# Altium schematic sheet ADC_CURRENT_PUMP.SchDoc
size 393 x 281 mm; PageSetup: Record=PageOptions|CenterHorizontal=True|CenterVertical=True|PrintScale=0.94|XCorrection=0.00|YCorrection=0.00|PrintKind=0|BorderSize=5000000|LeftOffset=0|BottomOffset=0|Orientation=2|PaperLength=1000|PaperWidth=1000|Scale=100|PaperSource=15|PrintQuality=600|MediaType=1|DitherType=10|PrintScaleMode=1|PaperKind=A4; Adr1: August Barks gata 6B; Adr2: SE-421 32 Västra Frölunda; Adr3: Sweden; Webpage: www.omnisys.se
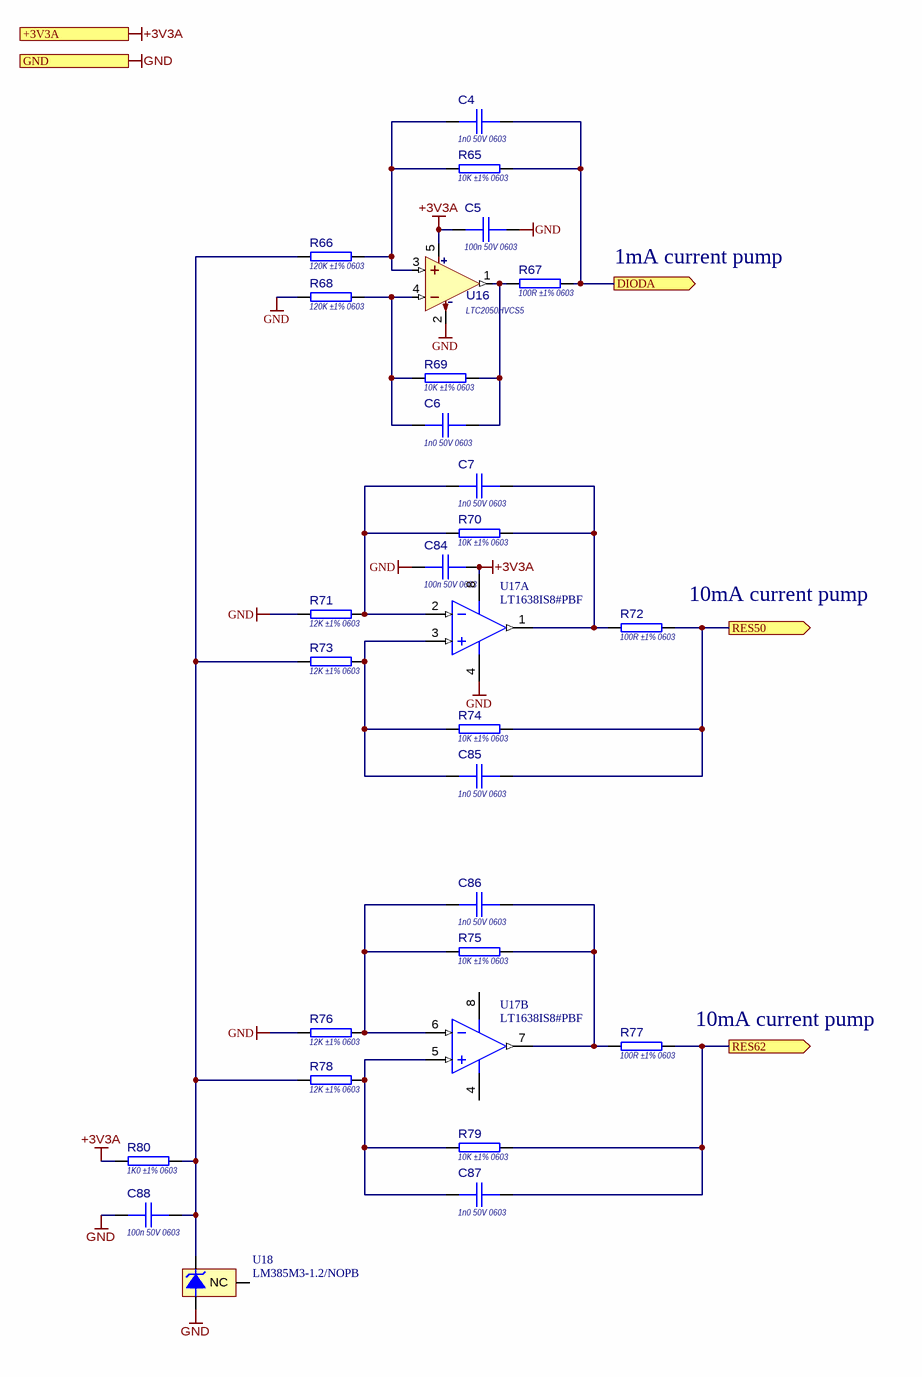
[diagram p0: ADC_CURRENT_PUMP.SchDoc]

## Parts
C4  1n0 50V 0603  [CAPC1608X90N]
C5  100n 50V 0603  [CAPC1608X90N]
C6  1n0 50V 0603  [CAPC1608X90N]
C7  1n0 50V 0603  [CAPC1608X90N]
C84  100n 50V 0603  [CAPC1608X90N]
C85  1n0 50V 0603  [CAPC1608X90N]
C86  1n0 50V 0603  [CAPC1608X90N]
C87  1n0 50V 0603  [CAPC1608X90N]
C88  100n 50V 0603  [CAPC1608X90N]
R65  10K ±1% 0603  [RESC1608N]
R66  120K ±1% 0603  [RESC1608N]
R67  100R ±1% 0603  [RESC1608N]
R68  120K ±1% 0603  [RESC1608N]
R69  10K ±1% 0603  [RESC1608N]
R70  10K ±1% 0603  [RESC1608N]
R71  12K ±1% 0603  [RESC1608N]
R72  100R ±1% 0603  [RESC1608N]
R73  12K ±1% 0603  [RESC1608N]
R74  10K ±1% 0603  [RESC1608N]
R75  10K ±1% 0603  [RESC1608N]
R76  12K ±1% 0603  [RESC1608N]
R77  100R ±1% 0603  [RESC1608N]
R78  12K ±1% 0603  [RESC1608N]
R79  10K ±1% 0603  [RESC1608N]
R80  1K0 ±1% 0603  [RESC1608N]
U16  LTC2050HVCS5  [SOT95P280X100-5N]
U17  LT1638IS8#PBF  [LT-S8-8_N]  (parts A,B of 2)
U18  LM385M3-1.2/NOPB  [DBZ0003A_L]

## Ports
+3V3A, DIODA (out), GND, RES50 (out), RES62 (out)

## Nets
+3V3A: C5.2 C84.2 R80.2 U16.5(+V) U17.8(V+) ; port +3V3A
GND: C5.1 C84.1 C88.1 R68.1 R71.1 R76.1 U16.2(-V) U17.4(V-) U18.2(-V) ; port GND
DIODA: C4.1 R65.2 R67.1 ; port DIODA
RES50: C85.1 R72.1 R74.2 ; port RES50
RES62: C87.1 R77.1 R79.1 ; port RES62
NetC4_2: C4.2 R65.1 R66.2 U16.3(+IN)
NetC6_1: C6.1 R67.2 R69.2 U16.1(OUT)
NetC6_2: C6.2 R68.2 R69.1 U16.4(-IN)
NetC7_1: C7.1 R70.1 R72.2 U17.1(OUT_A)
NetC7_2: C7.2 R70.2 R71.2 U17.2(-IN_A)
NetC85_2: C85.2 R73.2 R74.1 U17.3(+IN_A)
NetC86_1: C86.1 R75.1 R77.2 U17.7(OUT_B)
NetC86_2: C86.2 R75.2 R76.2 U17.6(-IN_B)
NetC87_2: C87.2 R78.2 R79.2 U17.5(+IN_B)
NetC88_2: C88.2 R66.1 R73.1 R78.1 R80.1 U18.1(+V)

Not connected (* = marked no-connect by the designer): U18 3(NC)

## Notes on the sheet
- 1mA current pump
- (near R72) 10mA current pump
- (near R77) 10mA current pump
- Title:
- SVN:
- August Barks gata 6B
- SE-421 32 Västra Frölunda
- Omnisys Instruments AB
- PCB ASY:
- PCB:
- SVN Folder:
- www.omnisys.se
- Page:
- of
- Print date:
- Page size:
- A3
- Information contained in this drawing is confidential. Copying, distributing or use in any matter, other than that specified by OMNISYS INSTRUMENTS AB, is strictly prohibited.

## Library data of the parts
C4 C6 C7 C85-C87 = CMP-0300-002637-1: 1n0 50V X7R ±10% 0603 (1608 metric); PartNumber: GRM188R71H102KA01; Rated voltage (V): 50; Capacitance (F): 1.0n; Package: 1608/0603; Temperature Charateristics: X7R; Thickness (mm): 0.90; Tolerance: ±10%
C5 C84 C88 = CMP-0300-002665-2: 100n 50V X7R ±10% 0603 (1608 metric); PartNumber: GRM188R71H104KA93; Rated voltage (V): 50; Capacitance (F): 100.0n; Package: 1608/0603; Temperature Charateristics: X7R; Thickness (mm): 0.90; Tolerance: ±10%
R65 R69 R70 R74 R75 R79 = CMP-1800-002045-3: 10K ±1% ±100 ppm/˚C 0.10W 75V 0603 (1608 metric); Power: 100mW; Case-EIA: 0603; Case-Metric: 1608; Temp. Coefficent: 0.01%; Value: 10k; Maximum working voltage: 75V; Tolerance: 1%; Technology: SMT
R66 R68 = CMP-1800-002071-3: 120K ±1% ±100 ppm/˚C 0.10W 75V 0603 (1608 metric); Power: 100mW; Case-EIA: 0603; Case-Metric: 1608; Temp. Coefficent: 0.01%; Value: 120k; Maximum working voltage: 75V; Tolerance: 1%; Technology: SMT
R67 R72 R77 = CMP-1800-001998-3: 100R ±1% ±100 ppm/˚C 0.10W 75V 0603 (1608 metric); Value: 100; Power: 100mW; Case-EIA: 0603; Case-Metric: 1608; Temp. Coefficent: 0.01%; Maximum working voltage: 75V; Tolerance: 1%; Technology: SMT
R71 R73 R76 R78 = CMP-1800-002047-3: 12K ±1% ±100 ppm/˚C 0.10W 75V 0603 (1608 metric); Power: 100mW; Case-EIA: 0603; Case-Metric: 1608; Temp. Coefficent: 0.01%; Value: 12k; Maximum working voltage: 75V; Tolerance: 1%; Technology: SMT
R80 = CMP-1800-002021-3: 1K0 ±1% ±100 ppm/˚C 0.10W 75V 0603 (1608 metric); Case-Metric: 1608; Temp. Coefficent: 0.01%; Value: 1k; Power: 100mW; Case-EIA: 0603; Maximum working voltage: 75V; Tolerance: 1%; Technology: SMT
U16 = CMP-2100-000329-1: Zero-Drift Operational Amplifiers in SOT-23
U17 = CMP-0359-03568-2: Dual Channel, High Voltage, Micropower Rail-to-Rail Operational Amplifier, 1.2 MHz Typical GBW, 0.38 V/us Typical SR, 2.2 to 44 V, 8-Pin SOIC (S8-8), Industrial, Pb-Free; Linear Technology Part Number: LT1638; Manufacturer: Linear Technology; SR (V/us) Typical: 0.38; GBW (MHz) Typical: 1.2; Vs Min (V): 2.2; Vs Max (V): 44; Is (mA) Typical: 0.17; Channels (#): 2; Vos (mV) Guaranteed: 0.6; Vos (mV) Typical: 0.2; RoHS: Pb-Free; ComponentLink1Description: Manufacturer URL; ComponentLink3URL: http://cds.linear.com/docs/en/packaging/05081610_G_SO8.pdf; PackageReference: LT-S8-8; ComponentLink2Description: Datasheet; ComponentLink3Description: Package Specification; ComponentLink2URL: http://cds.linear.com/docs/en/datasheet/16389fg.pdf; ComponentLink1URL: http://www.linear.com/; RevisionNote: URLs updated; Type: VFB; Mounting Technology: Surface Mount; PackageVersion: Rev G; PartNumber: LT1638IS8#PBF; PackageDescription: 8-Pin Plastic Small Outline, Body 4.9 x 3.9 mm, Pitch 1.27 mm; DatasheetVersion: Rev. G
U18 = CMP-0074-00629-3: Micropower Voltage Reference Diode, 3-pin SOT-23, Pb-Free; Manufacturer: Texas Instruments; CompType: Voltage Reference IC; PowerWise: N; PackageTopMarking: R11*XTT; PackageVersion: revB, Mar-2003; RoHS: Y; RevisionNote: Component URLs added; PinCount: 3; PackageDescription: Molded SOT-23, .115 x .051 x .037in Body, 3 Lead, .075 in Pitch; ComponentLink1Description: Datasheet URL; PackageReference: DBZ0003A; ComponentLink1URL: http://www.ti.com/general/docs/lit/getliterature.tsp?genericPartNumber=LM385-1.2-N&fileType=pdf; DatasheetVersion: Jan-2008